# Altium schematic sheet CPU.SchDoc
size A4; SheetNumber: 2; SheetTotal: 5
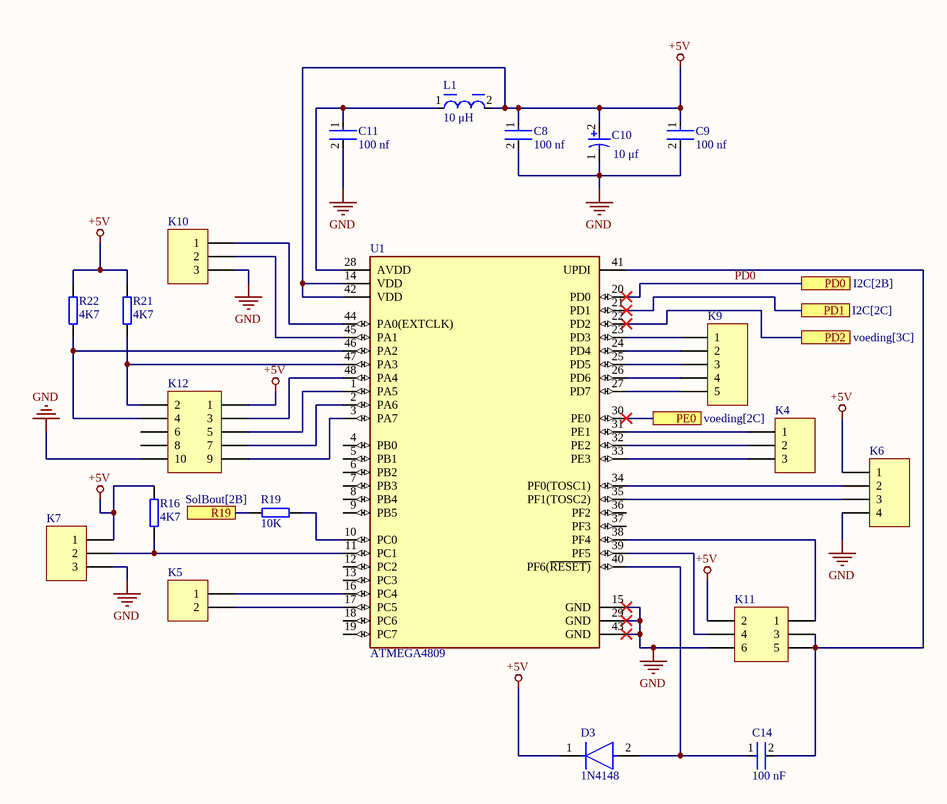
[diagram p0: CPU.SchDoc]

## Parts
C8  100 nf  [CC_0805_L]
C9  100 nf  [CC_0805_L]
C10  10 μf  [CE_D8_L10]
C11  100 nf  [CC_0805_L]
C14  100 nF  [CC_0805_L]
D3  1N4148  [SOD-123FL]
K4  (no value)  [HDR1X3]
K5  (no value)  [HDR1X2]
K6  (no value)  [HDR1X4]
K7  (no value)  [HDR1X3]
K9  (no value)  [HDR1X5]
K10  (no value)  [HDR1X3]
K11  (no value)  [HDR2X3]
K12  (no value)  [HDR2X5]
L1  10 μH  [CC_0805_L]
R16  4K7  [CC_0805_m]
R19  10K  [CC_0805_m]
R21  4K7  [CC_0805_m]
R22  4K7  [CC_0805_m]
U1  ATMEGA4809  [TQFP_48_M]

## Ports
PD0 (see I2C[2B]), PD1 (see I2C[2C]), PD2 (see voeding[3C]), PE0 (see voeding[2C]), R19 (see SolBout[2B])

## Nets
+5V: C8.1 C9.1 C10.2 D3.1(C) K6.1 K7.1 K11.2 K12.1 L1.2 R16.2 R21.2 R22.2 U1.14(VDD) U1.42(VDD)
GND: C8.2 C9.2 C10.1 C11.2 K6.4 K7.3 K10.3 K11.6 K12.10 U1.15(GND) U1.29(GND) U1.43(GND)
PD0: U1.20(PD0) ; port PD0
PD1: U1.21(PD1) ; port PD1
PD2: U1.22(PD2) ; port PD2
PE0: U1.30(PE0) ; port PE0
R19: R19.1 ; port R19
NetC11_1: C11.1 L1.1 U1.28(AVDD)
NetC14_1: C14.1 D3.2(A) U1.40(PF6(~{RESET)})
NetC14_2: C14.2 K11.3 K11.5 U1.41(UPDI)
NetK4_1: K4.1 U1.31(PE1)
NetK4_2: K4.2 U1.32(PE2)
NetK4_3: K4.3 U1.33(PE3)
NetK5_1: K5.1 U1.16(PC4)
NetK5_2: K5.2 U1.17(PC5)
NetK6_2: K6.2 U1.34(PF0(TOSC1))
NetK6_3: K6.3 U1.35(PF1(TOSC2))
NetK7_2: K7.2 R16.1 U1.11(PC1)
NetK9_1: K9.1 U1.23(PD3)
NetK9_2: K9.2 U1.24(PD4)
NetK9_3: K9.3 U1.25(PD5)
NetK9_4: K9.4 U1.26(PD6)
NetK9_5: K9.5 U1.27(PD7)
NetK10_1: K10.1 U1.44(PA0(EXTCLK))
NetK10_2: K10.2 U1.45(PA1)
NetK11_1: K11.1 U1.38(PF4)
NetK11_4: K11.4 U1.39(PF5)
NetK12_2: K12.2 R21.1 U1.47(PA3)
NetK12_3: K12.3 U1.48(PA4)
NetK12_4: K12.4 R22.1 U1.46(PA2)
NetK12_5: K12.5 U1.1(PA5)
NetK12_7: K12.7 U1.2(PA6)
NetK12_9: K12.9 U1.3(PA7)
NetR19_2: R19.2 U1.10(PC0)

Not connected (* = marked no-connect by the designer): K12 6 8; U1 4(PB0) 5(PB1) 6(PB2) 7(PB3) 8(PB4) 9(PB5) 12(PC2) 13(PC3) 18(PC6) 19(PC7) 36(PF2) 37(PF3)

## Library data of the parts
C8 C9 C11 C14 = Capacitor_Ceramic: Manufacturer: KEMET; Manufacturer Part Number: C0805C224K5RACTU; Value: 0.22 μF; Temperature Characteristic: X7R; Temperature Coefficient: 30ppm/°C; Tolerance: 0.1; Voltage Rating: 50 V; ComponentLink2URL: https://content.kemet.com/datasheets/KEM_C1003_C0G_SMD.pdf; Device Class L3: Ceramic Capacitors; Lead Free: Yes; Temperature: -55°C to +125°C; RoHS: TRUE; Capacitance: 0.22 μF; Automotive: No; Material: Ceramic; Octopart: https://octopart.com/c0805c224k5ractu-kemet-144670; Temperature Range Low: -55°C; Height: 0.88mm; Device Class L1: Passive Components; Digikey Description: CAP CER 0.22UF 50V X7R 0805; ComponentLink2Description: Datasheet; Mouser Description: CAP CER 0.22UF 50V X7R 0805; Category: Cap; Ipc Land Pattern Name: CAPC200125X78; Temperature Range High: +125°C; Package: C0805C-DN; Device Class L2: Capacitors
C10 = Capacitor_Electrolytic: Manufacturer: Panasonic; Voltage Rating: 25 V; ComponentLink2URL: http://industrial.panasonic.com/cdbs/www-data/pdf/RDE0000/ABA0000C1181.pdf; Height: 10.2 mm; Max Operating Temperature: 105 degC; PackageReference: EEE-FK1E221P; ComponentLink1Description: Manufacturer URL; ComponentLink1URL: http://www.panasonic.com/; Mount: Surface Mount; REACH SVHC: No SVHC; Min Operating Temperature: -55 degC; ComponentLink2Description: Datasheet; DatasheetVersion: 03/2016; Length: 10.2 mm; RoHSCompliant: true; Packaging: Tape and Reel; Package Quantity: 500; Lead Pitch: 3.1 mm; Pins: 2; PackageDescription: 2-Pin Electrolytic Aluminum Capacitor, Body 8.3 x 8.3 mm; Mounting Technology: Surface Mount
D3 = Diode: Manufacturer Part Number: 1N4007; Manufacturer: Diotec; Max Surge Forward Current: 27A; Forward Current: 1A; Max Junction Temp: +175°C; Reverse Voltage: 1000V; Value: 15pF; Peak Reverse Current: 5uA; Category: Diode; Temperature Range Low: -50°C; Automotive: No; Temperature: -50°C to +175°C; Lead Free: Yes; ComponentLink2Description: Datasheet; Max Repetitive Reverse Voltage: 1000V; ComponentLink2URL: https://datasheet.octopart.com/1N4007-Diotec-datasheet-62346875.pdf; Device Class L3: Rectifier Diodes; Height: 2.8mm; Octopart: https://octopart.com/1n4007-diotec-4040411; Package: 1N4007; Temperature Range High: +175°C; Device Class L1: Discrete Semiconductors; Device Class L2: Diodes; RoHS: TRUE; Capacitance: 15pF; Ipc Land Pattern Name: DIOAD888W100L520D280
K4 K7 K10 = Header 3: Header, 3-Pin; LatestRevisionDate: 17-Jul-2002; LatestRevisionNote: Re-released for DXP Platform.; Publisher: Altium Limited
K5 = Header 2: Header, 2-Pin; LatestRevisionDate: 17-Jul-2002; LatestRevisionNote: Re-released for DXP Platform.; Publisher: Altium Limited
K6 = Header 4: Header, 4-Pin; LatestRevisionDate: 17-Jul-2002; LatestRevisionNote: Re-released for DXP Platform.; Publisher: Altium Limited
K9 = Header 5: Header, 5-Pin; LatestRevisionDate: 17-Jul-2002; LatestRevisionNote: Re-released for DXP Platform.; Publisher: Altium Limited
K11 = Header 3X2: Header, 3-Pin, Dual row; LatestRevisionDate: 17-Jul-2002; LatestRevisionNote: Re-released for DXP Platform.; Publisher: Altium Limited
K12 = Header 5X2: Header, 5-Pin, Dual row; LatestRevisionDate: 17-Jul-2002; LatestRevisionNote: Re-released for DXP Platform.; Publisher: Altium Limited
L1 = Choke: Tolerance: 20%; Shielding: Shielded; Saturation Current: 10A; Test Frequency: 100kHz; RMS Current (Irms): 8.5A; Inductance: 10uH; Series Resistance: 14.1R; DC Resistance (DCR): 14.1mR; Self Resonant Frequency: 18MHz; Ratings: AEC-Q200; Width: 12.8mm; Series: WE-HCI; Length: 0.512inch; Mount: Surface Mount; Resistor Type: Wirewound; RoHS Compliant: Yes; Package Quantity: 1; Min Operating Temperature: -40°C; Inductance Tolerance: 20%; Termination: SMD/SMT; Max DC Current: 8.5A; Height - Seated (Max): 0.197inch; Case/Package: 1350; Current Rating: 8.5A; Max Operating Temperature: 155°C; Packaging: Tape and Reel; Height: 4.7mm
R16 R19 R21 R22 = Resistor: Manufacturer: Vishay Dale; Part Number: CRCW08050000Z0EA
U1 = ATMEGA4809: Peripherals: Brown-out Detect/Reset; Number of I/Os: 41; Core Architecture: AVR; Memory Size: 48KB; Interface: I2C; Oscillator Type: Internal; Memory Type: FLASH; Series: megaAVR® 0, Functional Safety (FuSa); Min Operating Temperature: -40°C; Mount: Surface Mount; Case/Package: TQFP; RoHS Compliant: Yes; Max Operating Temperature: 85°C